# EAGLE schematic EEG_2 (EAGLE 9.2.2)
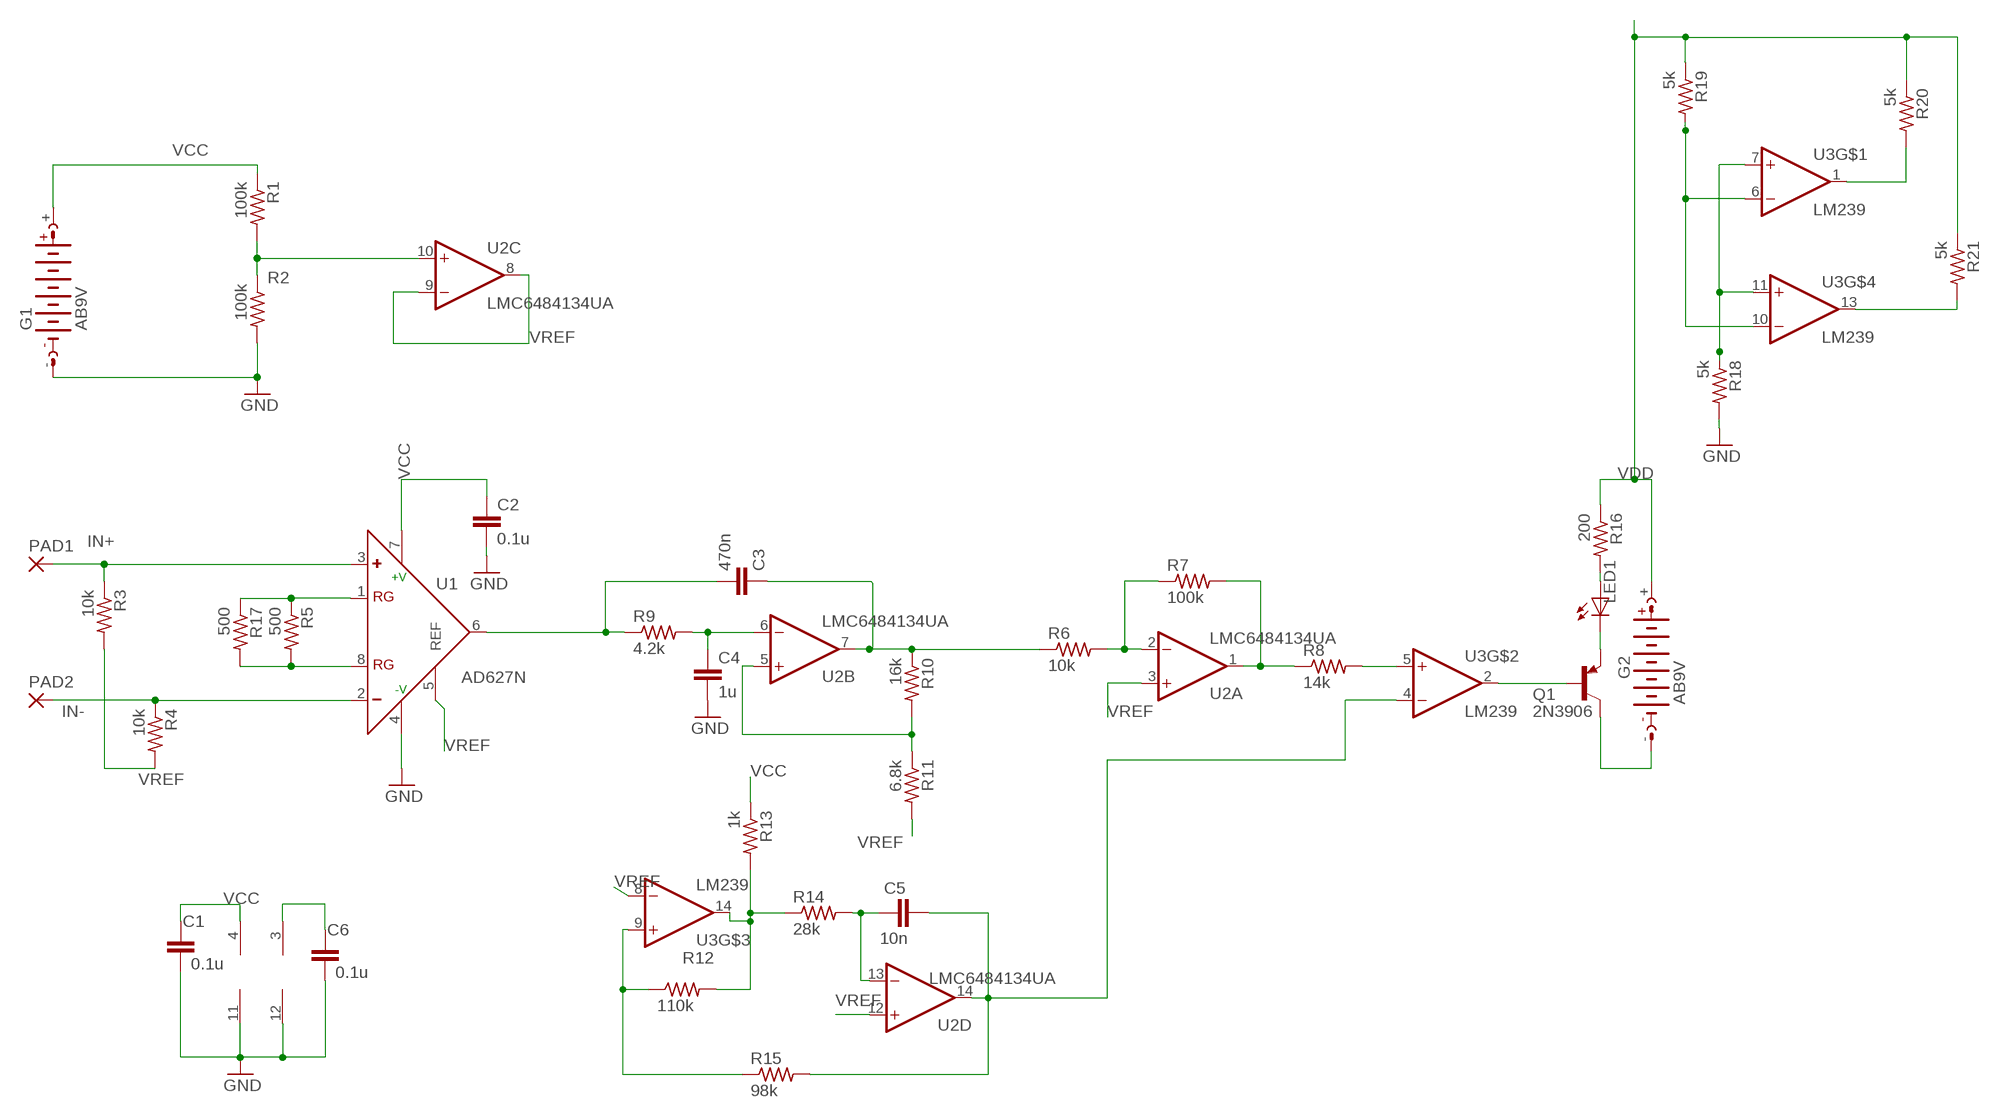
[diagram p0: schematic, sheet 1]

## Parts
C1  0.1u  C5/3  [C5B3]
C2  0.1u  C5/3  [C5B3]
C3  470n  C5/3  [C5B3]
C4  1u  C5/3  [C5B3]
C5  10n  C5/3  [C5B3]
C6  0.1u  C5/3  [C5B3]
G1  AB9V  [AB9V]
G2  AB9V  [AB9V]
LED1  LED5MM  [LED5MM]
PAD1  2,15/1,0  [2,15/1,0]
PAD2  2,15/1,0  [2,15/1,0]
Q1  2N3906  [TO92]
R1  100k  R-US_0207/7  [0207/7]
R2  100k  R-US_0207/7  [0207/7]
R3  10k  R-US_0207/7  [0207/7]
R4  10k  R-US_0207/7  [0207/7]
R5  500  R-US_0207/7  [0207/7]
R6  10k  R-US_0207/7  [0207/7]
R7  100k  R-US_0207/7  [0207/7]
R8  14k  R-US_0207/7  [0207/7]
R9  4.2k  R-US_0207/7  [0207/7]
R10  16k  R-US_0207/7  [0207/7]
R11  6.8k  R-US_0207/7  [0207/7]
R12  110k  R-US_0207/7  [0207/7]
R13  1k  R-US_0207/7  [0207/7]
R14  28k  R-US_0207/7  [0207/7]
R15  98k  R-US_0207/7  [0207/7]
R16  200  R-US_0207/7  [0207/7]
R17  500  R-US_0207/7  [0207/7]
R18  5k  R-US_0207/7  [0207/7]
R19  5k  R-US_0207/7  [0207/7]
R20  5k  R-US_0207/7  [0207/7]
R21  5k  R-US_0207/7  [0207/7]
U1  AD627N  [DIL08]
U2  LMC6484134UA  [SO14]
U3  LM239  [SO14]

## Nets
GND: C1.2 C2.2 C4.2 C6.2 G1.- R2.2 R18.2 U1.4(-V) U2.11(P:V-) U3.12(V-)
HELP: R1.2 R2.1 U2.10(C:+IN)
IN+: PAD1.1(P) R3.1 U1.3(+)
IN-: PAD2.1(P) R4.1 U1.2(-)
N$1: R6.2 R7.1 U2.2(A:-IN)
N$2: R20.2 U3.1(OUT)
N$3: C3.1 R9.1 U1.6(OUT)
N$4: R5.1 R17.1 U1.1(RG)
N$5: R7.2 R8.1 U2.1(A:OUT)
N$6: R5.2 R17.2 U1.8(RG)
N$7: R10.2 R11.1 U2.5(B:+IN)
N$8: C6.1 U3.3(V+)
N$9: C4.1 R9.2 U2.6(B:-IN)
N$11: C5.2 R14.2 U2.13(D:-IN)
N$12: R12.1 R15.1 U3.9(+IN)
N$13: R12.2 R13.2 R14.1 U3.14(OUT)
N$14: LED1.K(C) Q1.3(E)
N$15: C5.1 R15.2 U2.14(D:OUT) U3.4(-IN)
N$16: LED1.A R16.2
N$18: R19.2 U3.6(-IN) U3.10(-IN)
N$19: Q1.2(B) U3.2(OUT)
N$20: R18.1 U3.7(+IN) U3.11(+IN)
N$21: R8.2 U3.5(+IN)
N$29: R21.2 U3.13(OUT)
N$31: G2.- Q1.1(C)
N$32: C3.2 R6.1 R10.1 U2.7(B:OUT)
VCC: C1.1 C2.1 G1.+ R1.1 R13.1 U1.7(+V) U2.4(P:V+)
VDD: G2.+ R16.1 R19.1 R20.1 R21.1
VREF: R3.2 R4.2 R11.2 U1.5(REF) U2.3(A:+IN) U2.8(C:OUT) U2.9(C:-IN) U2.12(D:+IN) U3.8(-IN)

## Library data of the parts
C1-C6 = capacitor-wima:C: CAPACITOR naming: grid - package width
G1 G2 = battery:AB9V: 9-V BATTERY CLIP
LED1 = led:LED: LED OSRAM: - CHIPLED LG R971, LG N971, LY N971, LG Q971, LY Q971, LO R971, LY R971 LH N974, LH R974 LS Q976, LO Q976, LY Q976 LO Q996 - Hyper CHIPLED LW Q18S LB Q993, LB Q99A, LB R99A - SideLED LS A670, LO A670, LY A670, LG A670, LP A670 LB A673, LV A673, LT A673, LW A673 LH A674 LY A675 LS A676, LA A676, LO A676, LY A676, LW A676 LS A679, LY A679, LG A679 - Hyper Micro SIDELED® LS Y876, LA Y876, LO Y876, LY Y876 LT Y87S - SmartLED LW L88C, LW L88S LB L89C, LB L89S, LG L890 LS L89K, LO L89K, LY L89K LS L896, LA L896, LO L896, LY L896 - TOPLED LS T670, LO T670, LY T670, LG T670, LP T670 LSG T670, LSP T670, LSY T670, LOP T670, LYG T670 LG T671, LOG T671, LSG T671 LB T673, LV T673, LT T673, LW T673 LH T674 LS T676, LA T676, LO T676, LY T676, LB T676, LH T676, LSB T676, LW T676 LB T67C, LV T67C, LT T67C, LS T67K, LO T67K, LY T67K, LW E67C LS E67B, LA E67B, LO E67B, LY E67B, LB E67C, LV E67C, LT E67C LW T67C LS T679, LY T679, LG T679 LS T770, LO T770, LY T770, LG T770, LP T770 LB T773, LV T773, LT T773, LW T773 LH T774 LS E675, LA E675, LY E675, LS T675 LS T776, LA T776, LO T776, LY T776, LB T776 LHGB T686 LT T68C, LB T68C - Hyper Mini TOPLED® LB M676 - Mini TOPLED Santana® LG M470 LS M47K, LO M47K, LY M47K Source: http://www.osram.convergy.de LUXEON: - LUMILED® LXK2-PW12-R00, LXK2-PW12-S00, LXK2-PW14-U00, LXK2-PW14-V00 LXK2-PM12-R00, LXK2-PM12-S00, LXK2-PM14-U00 LXK2-PE12-Q00, LXK2-PE12-R00, LXK2-PE12-S00, LXK2-PE14-T00, LXK2-PE14-U00 LXK2-PB12-K00, LXK2-PB12-L00, LXK2-PB12-M00, LXK2-PB14-N00, LXK2-PB14-P00, LXK2-PB14-Q00 LXK2-PR12-L00, LXK2-PR12-M00, LXK2-PR14-Q00, LXK2-PR14-R00 LXK2-PD12-Q00, LXK2-PD12-R00, LXK2-PD12-S00 LXK2-PH12-R00, LXK2-PH12-S00 LXK2-PL12-P00, LXK2-PL12-Q00, LXK2-PL12-R00 Source: www.luxeon.com KINGBRIGHT: KA-3528ASYC Source: www.kingbright.com
PAD1 PAD2 = wirepad:2,15/1,0: THROUGH-HOLE PAD
Q1 = transistor-pnp:2N3906: PNP Transistor
R1-R21 = rcl:R-US_: RESISTOR, American symbol; SPICEPREFIX: R
U1 = analog-devices:AD627: Micropower, Single- and Dual-Supply, Rail-to-Rail Instrumentation Amplifier Source: http://www.analog.com/static/imported-files/data_sheets/AD627.pdf; MF: ALTERA CORPORATION; MPN: AD627BNZ; OC_FARNELL: 1438354; OC_NEWARK: 59K4418
U2 = LMC6484:LMC6484: Quad Operational Amplifier compatible with: TLC27L4 Low Power, Single-Supply, Rail-To-Rail Operational Amplifier Source: http://focus.ti.com/lit/ds/symlink/opa2345.pdf http://focus.ti.com .. opa241.pdf http://focus.ti.com .. tlc27l4.pdf http://focus.ti.com/lit/ds/symlink/opa2134.pdf
U3 = LMC6484:LM239